# Altium schematic sheet uC.SchDoc
size A4; PageSetup: Record=PageOptions|CenterHorizontal=True|CenterVertical=True|PrintScale=1.00|XCorrection=1.00|YCorrection=1.00|PrintKind=0|BorderSize=5000000|LeftOffset=0|BottomOffset=0|Orientation=2|PaperLength=1000|PaperWidth=1000|Scale=100|PaperSource=7|PrintQuality=-3|MediaType=1|DitherType=10|PrintScaleMode=1|PaperKind=A4|PaperIndex=9
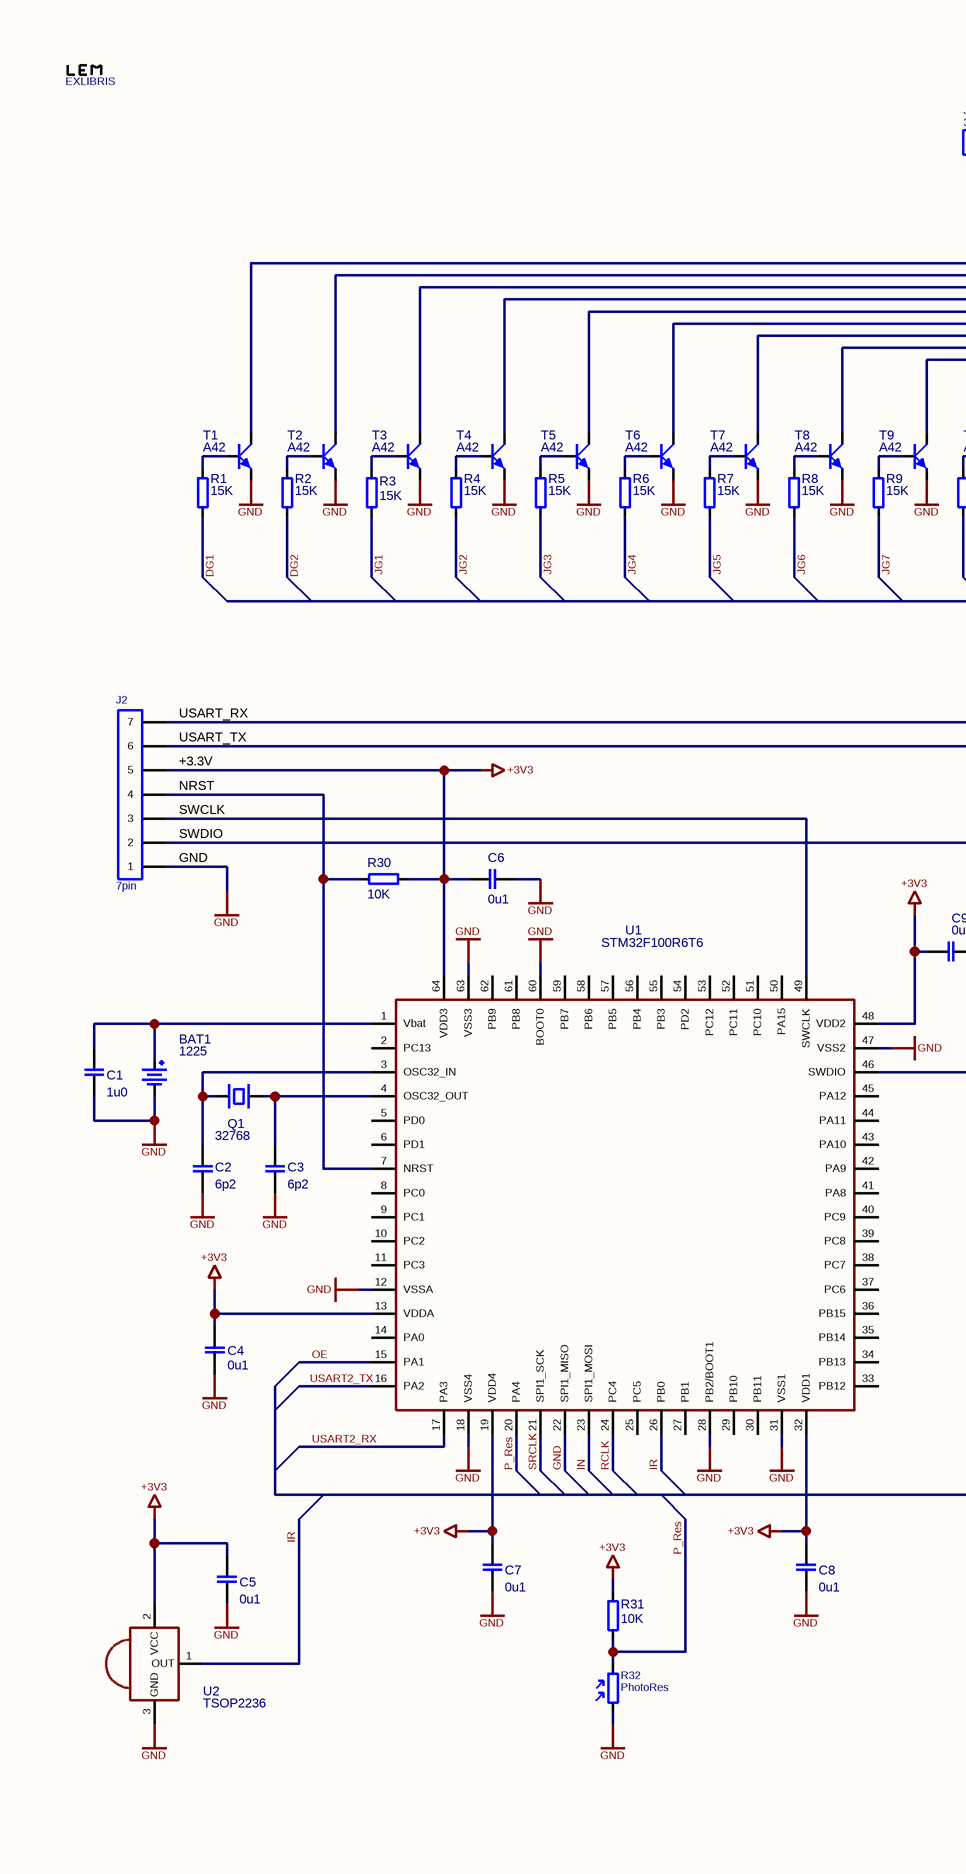
[diagram p0: uC.SchDoc, left]
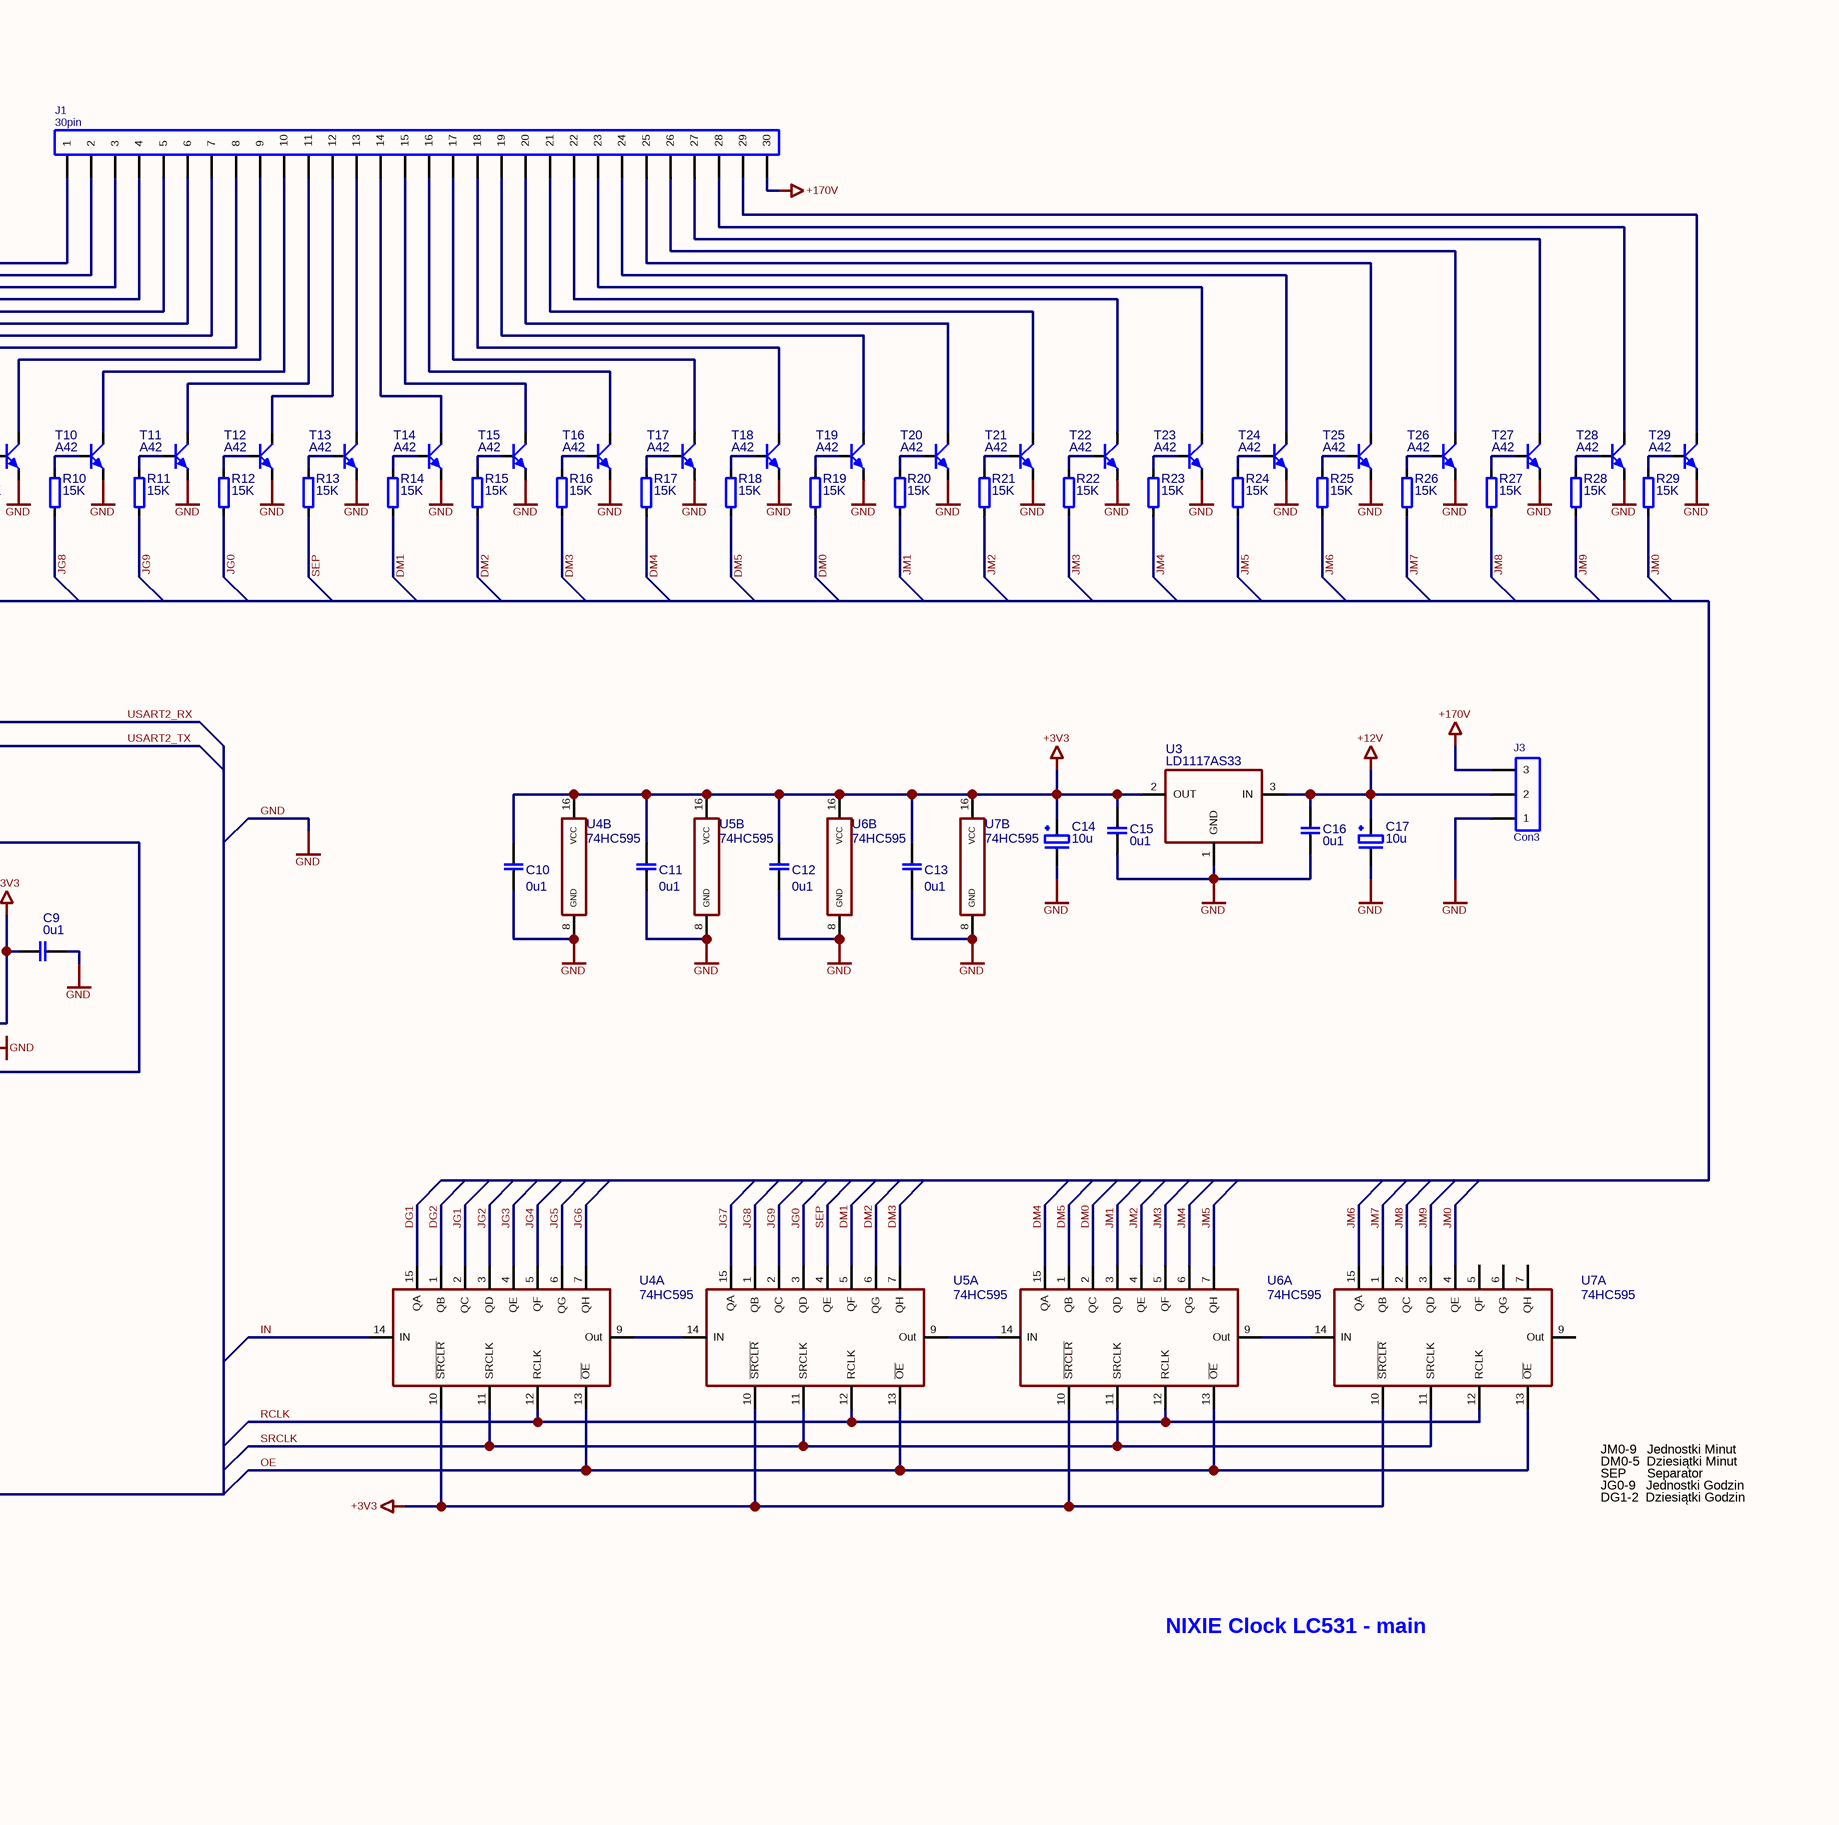
[diagram p1: uC.SchDoc, right]

## Parts
BAT1  1225  [SMTU-1225]
C1  1u0  [C_SMD_0805]
C2  6p2  [C_SMD_0805]
C3  6p2  [C_SMD_0805]
C4  0u1  [C_SMD_0603]
C5  0u1  [C_SMD_0603]
C6  0u1  [C_SMD_0603]
C7  0u1  [C_SMD_0603]
C8  0u1  [C_SMD_0603]
C9  0u1  [C_SMD_0603]
C10  0u1  [C_SMD_0603]
C11  0u1  [C_SMD_0603]
C12  0u1  [C_SMD_0603]
C13  0u1  [C_SMD_0603]
C14  10u  [CE_T_SMC_6032_28]
C15  0u1  [C_SMD_0603]
C16  0u1  [C_SMD_0603]
C17  10u  [CE_T_SMC_6032_28]
EXLIBRIS  EXLIBRIS  [EXLBS_2]
J1  30pin  [SIL30]
J2  7pin  [SIL7_SMD_Horizontal]
J3  Con3  [TE_147323-2]
Q1  32768  [XTAL_3]
R1  15K  [R_SMD_0603]
R2  15K  [R_SMD_0603]
R3  15K  [R_SMD_0603]
R4  15K  [R_SMD_0603]
R5  15K  [R_SMD_0603]
R6  15K  [R_SMD_0603]
R7  15K  [R_SMD_0603]
R8  15K  [R_SMD_0603]
R9  15K  [R_SMD_0603]
R10  15K  [R_SMD_0603]
R11  15K  [R_SMD_0603]
R12  15K  [R_SMD_0603]
R13  15K  [R_SMD_0603]
R14  15K  [R_SMD_0603]
R15  15K  [R_SMD_0603]
R16  15K  [R_SMD_0603]
R17  15K  [R_SMD_0603]
R18  15K  [R_SMD_0603]
R19  15K  [R_SMD_0603]
R20  15K  [R_SMD_0603]
R21  15K  [R_SMD_0603]
R22  15K  [R_SMD_0603]
R23  15K  [R_SMD_0603]
R24  15K  [R_SMD_0603]
R25  15K  [R_SMD_0603]
R26  15K  [R_SMD_0603]
R27  15K  [R_SMD_0603]
R28  15K  [R_SMD_0603]
R29  15K  [R_SMD_0603]
R30  10K  [R_SMD_0603]
R31  10K  [R_SMD_0603]
R32  PhotoRes  [R_Photo_V]
T1  A42  [SOT-23 - Basic]
T2  A42  [SOT-23 - Basic]
T3  A42  [SOT-23 - Basic]
T4  A42  [SOT-23 - Basic]
T5  A42  [SOT-23 - Basic]
T6  A42  [SOT-23 - Basic]
T7  A42  [SOT-23 - Basic]
T8  A42  [SOT-23 - Basic]
T9  A42  [SOT-23 - Basic]
T10  A42  [SOT-23 - Basic]
T11  A42  [SOT-23 - Basic]
T12  A42  [SOT-23 - Basic]
T13  A42  [SOT-23 - Basic]
T14  A42  [SOT-23 - Basic]
T15  A42  [SOT-23 - Basic]
T16  A42  [SOT-23 - Basic]
T17  A42  [SOT-23 - Basic]
T18  A42  [SOT-23 - Basic]
T19  A42  [SOT-23 - Basic]
T20  A42  [SOT-23 - Basic]
T21  A42  [SOT-23 - Basic]
T22  A42  [SOT-23 - Basic]
T23  A42  [SOT-23 - Basic]
T24  A42  [SOT-23 - Basic]
T25  A42  [SOT-23 - Basic]
T26  A42  [SOT-23 - Basic]
T27  A42  [SOT-23 - Basic]
T28  A42  [SOT-23 - Basic]
T29  A42  [SOT-23 - Basic]
U1  STM32F100R6T6  [LQFP-674]
U2  TSOP2236  [TSOP-2236]
U3  LD1117AS33  [SOT-223]
U4  74HC595  [SO-16_150]  (parts A,B of 2)
U5  74HC595  [SO-16_150]  (parts A,B of 2)
U6  74HC595  [SO-16_150]  (parts A,B of 2)
U7  74HC595  [SO-16_150]  (parts A,B of 2)

## Nets
+3V3: C4.1 C5.2 C6.2 C7.2 C8.2 C9.1 C10.2 C11.2 C12.2 C13.2 C14.2(+) C15.2 J2.5 R30.1 R31.1 U1.13(VDDA) U1.19(VDD4) U1.32(VDD1) U1.48(VDD2) U1.64(VDD3) U2.2(VCC) U3.2(OUT) U4.10(~{SRCLR}) U4.16(VCC) U5.10(~{SRCLR}) U5.16(VCC) U6.10(~{SRCLR}) U6.16(VCC) U7.10(~{SRCLR}) U7.16(VCC)
+12V: C16.2 C17.2(+) J3.2 U3.3(IN)
+170V: J1.30 J3.3
GND: BAT1.2(-) C1.1 C2.1 C3.1 C4.2 C5.1 C6.1 C7.1 C8.1 C9.2 C10.1 C11.1 C12.1 C13.1 C14.1(-) C15.1 C16.1 C17.1(-) J2.1 J3.1 R32.2(+) T1.2(Emitter) T2.2(Emitter) T3.2(Emitter) T4.2(Emitter) T5.2(Emitter) T6.2(Emitter) T7.2(Emitter) T8.2(Emitter) T9.2(Emitter) T10.2(Emitter) T11.2(Emitter) T12.2(Emitter) T13.2(Emitter) T14.2(Emitter) T15.2(Emitter) T16.2(Emitter) T17.2(Emitter) T18.2(Emitter) T19.2(Emitter) T20.2(Emitter) T21.2(Emitter) T22.2(Emitter) T23.2(Emitter) T24.2(Emitter) T25.2(Emitter) T26.2(Emitter) T27.2(Emitter) T28.2(Emitter) T29.2(Emitter) U1.12(VSSA) U1.18(VSS4) U1.22(SPI1_MISO) U1.28(PB2/BOOT1) U1.31(VSS1) U1.47(VSS2) U1.60(BOOT0) U1.63(VSS3) U2.3(GND) U3.1(GND) U4.8(GND) U5.8(GND) U6.8(GND) U7.8(GND)
DG1: R1.1 U4.15(QA)
DG2: R2.1 U4.1(QB)
DM0: R19.1 U6.2(QC)
DM1: R14.1 U5.5(QF)
DM2: R15.1 U5.6(QG)
DM3: R16.1 U5.7(QH)
DM4: R17.1 U6.15(QA)
DM5: R18.2 U6.1(QB)
IN: U1.23(SPI1_MOSI) U4.14(IN)
IR: U1.26(PB0) U2.1(OUT)
JG0: R12.1 U5.3(QD)
JG1: R3.1 U4.2(QC)
JG2: R4.1 U4.3(QD)
JG3: R5.1 U4.4(QE)
JG4: R6.1 U4.5(QF)
JG5: R7.1 U4.6(QG)
JG6: R8.2 U4.7(QH)
JG7: R9.1 U5.15(QA)
JG8: R10.1 U5.1(QB)
JG9: R11.1 U5.2(QC)
JM0: R29.1 U7.4(QE)
JM1: R20.1 U6.3(QD)
JM2: R21.1 U6.4(QE)
JM3: R22.1 U6.5(QF)
JM4: R23.2 U6.6(QG)
JM5: R24.1 U6.7(QH)
JM6: R25.1 U7.15(QA)
JM7: R26.1 U7.1(QB)
JM8: R27.1 U7.2(QC)
JM9: R28.2 U7.3(QD)
OE: U1.15(PA1) U4.13(~{OE}) U5.13(~{OE}) U6.13(~{OE}) U7.13(~{OE})
P_Res: R31.2 R32.1(-) U1.20(PA4)
RCLK: U1.24(PC4) U4.12(RCLK) U5.12(RCLK) U6.12(RCLK) U7.12(RCLK)
SEP: R13.2 U5.4(QE)
SRCLK: U1.21(SPI1_SCK) U4.11(SRCLK) U5.11(SRCLK) U6.11(SRCLK) U7.11(SRCLK)
USART2_RX: J2.7 U1.17(PA3)
USART2_TX: J2.6 U1.16(PA2)
NetBAT1_1: BAT1.1(+) C1.2 U1.1(Vbat)
NetC2_2: C2.2 Q1.1 U1.3(OSC32_IN)
NetC3_2: C3.2 Q1.2 U1.4(OSC32_OUT)
NetJ1_1: J1.1 T1.3(Collector)
NetJ1_2: J1.2 T2.3(Collector)
NetJ1_3: J1.3 T3.3(Collector)
NetJ1_4: J1.4 T4.3(Collector)
NetJ1_5: J1.5 T5.3(Collector)
NetJ1_6: J1.6 T6.3(Collector)
NetJ1_7: J1.7 T7.3(Collector)
NetJ1_8: J1.8 T8.3(Collector)
NetJ1_9: J1.9 T9.3(Collector)
NetJ1_10: J1.10 T10.3(Collector)
NetJ1_11: J1.11 T11.3(Collector)
NetJ1_12: J1.12 T12.3(Collector)
NetJ1_13: J1.13 T13.3(Collector)
NetJ1_14: J1.14 T14.3(Collector)
NetJ1_15: J1.15 T15.3(Collector)
NetJ1_16: J1.16 T16.3(Collector)
NetJ1_17: J1.17 T17.3(Collector)
NetJ1_18: J1.18 T18.3(Collector)
NetJ1_19: J1.19 T19.3(Collector)
NetJ1_20: J1.20 T20.3(Collector)
NetJ1_21: J1.21 T21.3(Collector)
NetJ1_22: J1.22 T22.3(Collector)
NetJ1_23: J1.23 T23.3(Collector)
NetJ1_24: J1.24 T24.3(Collector)
NetJ1_25: J1.25 T25.3(Collector)
NetJ1_26: J1.26 T26.3(Collector)
NetJ1_27: J1.27 T27.3(Collector)
NetJ1_28: J1.28 T28.3(Collector)
NetJ1_29: J1.29 T29.3(Collector)
NetJ2_2: J2.2 U1.46(SWDIO)
NetJ2_3: J2.3 U1.49(SWCLK)
NetJ2_4: J2.4 R30.2 U1.7(NRST)
NetR1_2: R1.2 T1.1(Base)
NetR2_2: R2.2 T2.1(Base)
NetR3_2: R3.2 T3.1(Base)
NetR4_2: R4.2 T4.1(Base)
NetR5_2: R5.2 T5.1(Base)
NetR6_2: R6.2 T6.1(Base)
NetR7_2: R7.2 T7.1(Base)
NetR8_1: R8.1 T8.1(Base)
NetR9_2: R9.2 T9.1(Base)
NetR10_2: R10.2 T10.1(Base)
NetR11_2: R11.2 T11.1(Base)
NetR12_2: R12.2 T12.1(Base)
NetR13_1: R13.1 T13.1(Base)
NetR14_2: R14.2 T14.1(Base)
NetR15_2: R15.2 T15.1(Base)
NetR16_2: R16.2 T16.1(Base)
NetR17_2: R17.2 T17.1(Base)
NetR18_1: R18.1 T18.1(Base)
NetR19_2: R19.2 T19.1(Base)
NetR20_2: R20.2 T20.1(Base)
NetR21_2: R21.2 T21.1(Base)
NetR22_2: R22.2 T22.1(Base)
NetR23_1: R23.1 T23.1(Base)
NetR24_2: R24.2 T24.1(Base)
NetR25_2: R25.2 T25.1(Base)
NetR26_2: R26.2 T26.1(Base)
NetR27_2: R27.2 T27.1(Base)
NetR28_1: R28.1 T28.1(Base)
NetR29_2: R29.2 T29.1(Base)
NetU4_9: U4.9(Out) U5.14(IN)
NetU5_9: U5.9(Out) U6.14(IN)
NetU6_9: U6.9(Out) U7.14(IN)

Not connected (* = marked no-connect by the designer): U1 2(PC13) 5(PD0) 6(PD1) 8(PC0) 9(PC1) 10(PC2) 11(PC3) 14(PA0) 25(PC5) 27(PB1) 29(PB10) 30(PB11) 33(PB12) 34(PB13) 35(PB14) 36(PB15) 37(PC6) 38(PC7) 39(PC8) 40(PC9) 41(PA8) 42(PA9) 43(PA10) 44(PA11) 45(PA12) 50(PA15) 51(PC10) 52(PC11) 53(PC12) 54(PD2) 55(PB3) 56(PB4) 57(PB5) 58(PB6) 59(PB7) 61(PB8) 62(PB9); U7 5(QF) 6(QG) 7(QH) 9(Out)

## Notes on the sheet
- (near J2) +3.3V
- (near J2) NRST
- (near J2) USART_RX
- (near J2) USART_TX
- (near J2) SWDIO
- (near J2) SWCLK
- (near J2) GND
- (near U7) JM0-9   Jednostki Minut
- (near U7) DM0-5  Dziesiątki Minut
- (near U7) SEP      Separator
- JG0-9   Jednostki Godzin
- DG1-2  Dziesiątki Godzin
- NIXIE Clock LC531 - main

## Library data of the parts
BAT1 = BAT_3V: Bateria Litowa 3V
C1-C13 C15 C16 = C: Kondensator monolityczny
C14 C17 = CE: Kondensator elektrolityczny
EXLIBRIS = EXLBR
J1 = CON 30pin
J2 = CON 7pin: Connector 7pin
J3 = CON 3pin: Connector 3pin
Q1 = Q: Rezonator kwarcowy
R1-R31 = R: Resistor
R32 = R_Ph: Photo resistor
T1-T29 = MMBTA42: High Voltage NPN transistor
U2 = IR Reciver
U3 = AMS1117_3V3
U4-U7 = 74595: 8-bit shift registers with 3-state output